# EAGLE design TFTProtoBreakout (EAGLE 7.2.0)
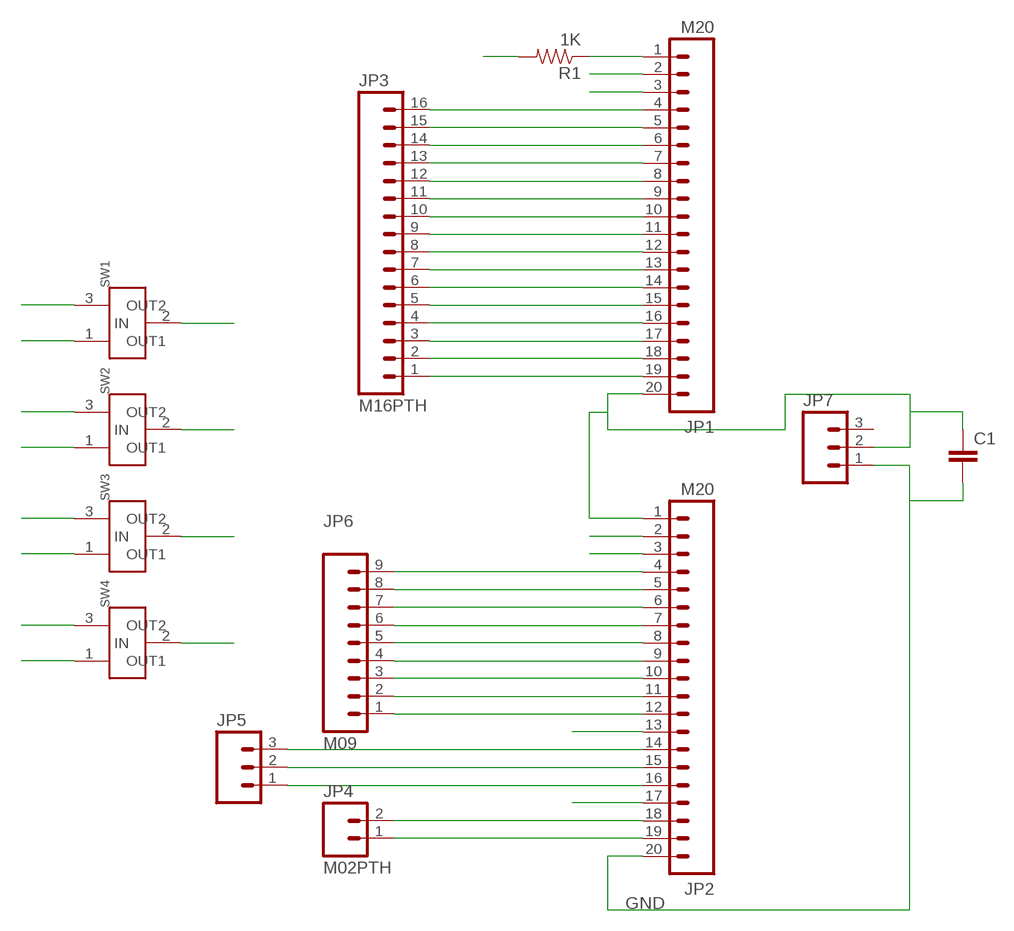
[diagram p0: schematic, sheet 1]

## Parts
C1  CAP0805  [0805]
JP1  M20  [1X20]
JP2  M20  [1X20]
JP3  M16PTH  [1X16]
JP4  M02PTH  [1X02]
JP5  M03PTH  [1X03]
JP6  M09  [1X09]
JP7  M03PTH  [1X03]
R1  1K  1KOHM1/10W1%(0603)  [0603-RES]
SW1  PCM12SMTR  [PCM12SMTR]
SW2  PCM12SMTR  [PCM12SMTR]
SW3  PCM12SMTR  [PCM12SMTR]
SW4  PCM12SMTR  [PCM12SMTR]

## Nets
D0: JP1.13 JP3.7
D1: JP2.12 JP6.1
D2: JP1.12 JP3.8
D3: JP2.11 JP6.2
D4: JP1.11 JP3.9
D5: JP2.10 JP6.3
D6: JP1.10 JP3.10
D7: JP2.9 JP6.4
D8: JP1.9 JP3.11
D9: JP2.8 JP6.5
D10: JP1.8 JP3.12
D11: JP2.7 JP6.6
D12: JP1.7 JP3.13
D13: JP2.6 JP6.7
D14: JP1.6 JP3.14
D15: JP2.5 JP6.8
D16: JP1.5 JP3.15
D17: JP2.4 JP6.9
FMARK: JP1.17 JP3.3
GND: C1.2 JP2.13 JP2.17 JP2.20 JP7.1 R1.2 SW1.1(OUT1) SW2.1(OUT1) SW3.1(OUT1) SW4.1(OUT1)
IM0: JP1.2 SW1.2(IN)
IM1: JP2.2 SW2.2(IN)
IM2: JP1.3 SW3.2(IN)
IM3: JP2.3 SW4.2(IN)
LEDK: JP1.1 R1.1
NCS: JP2.16 JP5.1
NRD: JP1.15 JP3.5
NRST: JP1.4 JP3.16
NWR_SCL: JP2.15 JP5.2
RS: JP1.16 JP3.4
SDI: JP2.14 JP5.3
SDO: JP1.14 JP3.6
VCC: C1.1 JP1.20 JP2.1 JP7.2 SW1.3(OUT2) SW2.3(OUT2) SW3.3(OUT2) SW4.3(OUT2)
X+: JP1.18 JP3.2
X-: JP1.19 JP3.1
Y+: JP2.18 JP4.2
Y-: JP2.19 JP4.1
Unconnected: JP7.3

## Library data of the parts
C1 = SparkFun-Capacitors:CAP: Capacitor Standard 0603 ceramic capacitor, and 0.1" leaded capacitor.
JP1 JP2 = SparkFun-Connectors:M20: 1x20 .1" header This is just like the LOCK variant in that the holes are staggared by 5 mil, but except for the last two holes. They are not altered from the "standard" footprint layout. This is used for a special purpose on the layout of our Graphic LCD Backpack. Make sure you want to use this device before selecting it for you project!
JP3 = SparkFun-Connectors:M16: 1x16 .1" header
JP4 = SparkFun-Connectors:M02: Standard 2-pin 0.1" header. Use with - straight break away headers ( PRT-00116) - right angle break away headers (PRT-00553) - swiss pins (PRT-00743) - machine pins (PRT-00117) - female headers (PRT-00115) Molex polarized connector foot print use with: PRT-08233 with associated crimp pins and housings. 2.54_SCREWTERM for use with PRT-10571. 3.5mm Screw Terminal footprints for PRT-08084 5mm Screw Terminal footprints for use with PRT-08433
JP5 JP7 = SparkFun-Connectors:M03: Header 3 Standard 3-pin 0.1" header. Use with straight break away headers (SKU : PRT-00116), right angle break away headers (PRT-00553), swiss pins (PRT-00743), machine pins (PRT-00117), and female headers (PRT-00115). Molex polarized connector foot print use with SKU : PRT-08232 with associated crimp pins and housings.
JP6 = SparkFun-Connectors:M09: Header 9 Standard 9-pin 0.1" header. Use with straight break away headers (SKU : PRT-00116), right angle break away headers (PRT-00553), swiss pins (PRT-00743), machine pins (PRT-00117), and female headers (PRT-00115).
R1 = SparkFun-Resistors:1KOHM1/10W1%(0603): RES-07856; PROD_ID: RES-07856
SW1-SW4 = freddyLibr:PCM12SMTR: Three pin switch. Horizontal gull wing surface mount.

## Board
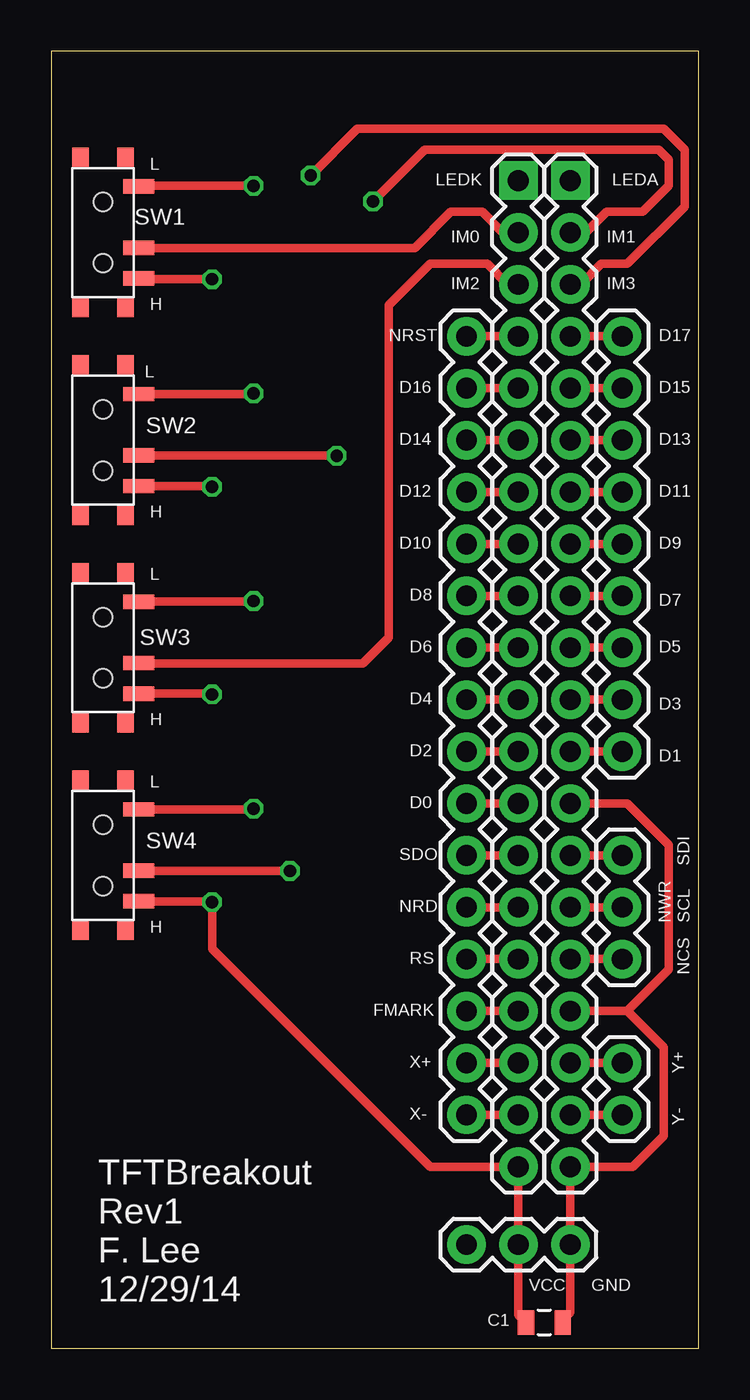
[diagram p1: board, top side]
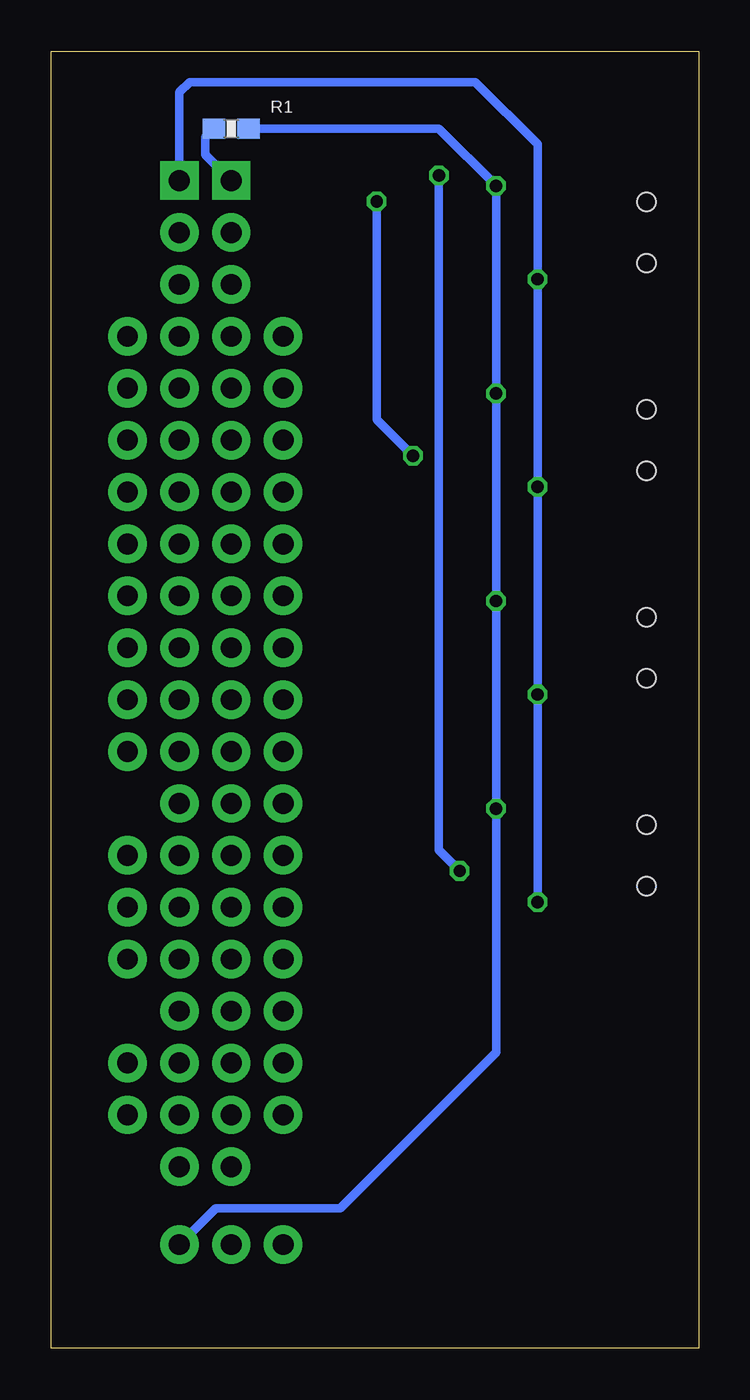
[diagram p2: board, bottom side, seen from below]

Size 31.67 x 63.49 mm. Coordinates in mm from the lower left corner, seen from the top.
Outline: 0,0 31.67,0 31.67,63.49 0,63.49 0,0
Copper layers (1*16): Top 0.0356mm / dielectric 1.5011mm / Bottom 0.0356mm
Design rules "LaenPCBOrder": minimum track width 6mil, minimum drill 13mil, track to track 6mil, track to pad 6mil, pad to pad 6mil, via to via 6mil, smd to smd 6mil, copper to edge 15mil, drill to drill 6mil, minimum pad ring 7mil, minimum via ring 7mil, stop-mask expansion 3mil, vias tented up to drill 0mil, thermal gap 10mil

### Footprints (pad centres in the part's own frame; a part is rotated, then mirrored left to right if it is on the bottom)
0805 = smd 0.8 x 1.2: 1 -0.9,0; 2 0.9,0
1X20 = drill 1.016 pad 1.88 square: 1 0,0 | drill 1.016 pad 1.88: 2 2.54,0; 3 5.08,0; 4 7.62,0; 5 10.16,0; 6 12.7,0; 7 15.24,0; 8 17.78,0; 9 20.32,0; 10 22.86,0; 11 25.4,0; 12 27.94,0; 13 30.48,0; 14 33.02,0; 15 35.56,0; 16 38.1,0; 17 40.64,0; 18 43.18,0; 19 45.72,0; 20 48.26,0
1X16 = drill 1.016 pad 1.88: 1 0,0; 2 2.54,0; 3 5.08,0; 4 7.62,0; 5 10.16,0; 6 12.7,0; 7 15.24,0; 8 17.78,0; 9 20.32,0; 10 22.86,0; 11 25.4,0; 12 27.94,0; 13 30.48,0; 14 33.02,0; 15 35.56,0; 16 38.1,0
1X02 = drill 1.016 pad 1.88: 1 0,0; 2 2.54,0
1X03 = drill 1.016 pad 1.88: 1 0,0; 2 2.54,0; 3 5.08,0
1X09 = drill 1.016 pad 1.88: 1 0,0; 2 2.54,0; 3 5.08,0; 4 7.62,0; 5 10.16,0; 6 12.7,0; 7 15.24,0; 8 17.78,0; 9 20.32,0
0603-RES = smd 1.1 x 1: 1 -0.85,0; 2 0.85,0
PCM12SMTR = smd 0.7 x 1.5: 1 -2.25,1.75; 2 0.75,1.75; 3 2.25,1.75 | smd 1 x 0.8: 4 -3.65,1.1; 5 -3.65,-1.1; 6 3.65,1.1; 7 3.65,-1.1 | hole 0.9: -1.5,0; 1.5,0

### Placement (x,y rotation side)
C1  24.13,1.27 0 top
JP1  22.86,57.15 270 top
JP2  25.4,57.15 270 top
JP3  20.32,11.43 90 top
JP4  27.94,11.43 90 top
JP5  27.94,19.05 90 top
JP6  27.94,29.21 90 top
JP7  25.4,5.08 180 top
R1  22.86,59.69 0 bottom
SW1  2.54,54.61 270 top
SW2  2.54,44.45 270 top
SW3  2.54,34.29 270 top
SW4  2.54,24.13 270 top

### Tracks (layer width: path | path; a pad name or v marks a point on that pad's centre or on a via)
D0
  Top 0.406: JP3.7 JP1.13
D1
  Top 0.406: JP6.1 JP2.12
D2
  Top 0.406: JP3.8 JP1.12
D3
  Top 0.406: JP2.11 JP6.2
D4
  Top 0.406: JP3.9 JP1.11
D5
  Top 0.406: JP6.3 JP2.10
D6
  Top 0.406: JP3.10 JP1.10
D7
  Top 0.406: JP2.9 JP6.4
D8
  Top 0.406: JP3.11 JP1.9
D9
  Top 0.406: JP6.5 JP2.8
D10
  Top 0.406: JP3.12 JP1.8
D11
  Top 0.406: JP2.7 JP6.6
D12
  Top 0.406: JP3.13 JP1.7
D13
  Top 0.406: JP6.7 JP2.6
D14
  Top 0.406: JP3.14 JP1.6
D15
  Top 0.406: JP6.8 JP2.5
D16
  Top 0.406: JP3.15 JP1.5
D17
  Top 0.406: JP2.4 JP6.9
FMARK
  Top 0.406: JP3.3 JP1.17
GND  (via drill 0.6)
  Top 0.406: 28.19,16.51 30.23,18.54 30.23,24.64 28.19,26.67 JP2.13 | JP2.17 28.19,16.51 | 28.19,16.51 29.97,14.73 29.97,10.41 28.45,8.89 JP2.20 JP7.1 25.4,1.78 25.03,1.41 C1.2 | v9.91,56.9 4.33,56.9 SW1.1 | SW2.1 9.87,46.7 v9.91,46.74 | SW3.1 9.87,36.54 v9.91,36.58 | SW4.1 9.87,26.38 v9.91,26.42
  Bottom 0.406: R1.2 12.7,59.69 v9.91,56.9 v9.91,46.74 v9.91,36.58 v9.91,26.42 9.91,14.48 17.53,6.86 23.62,6.86 JP7.1
IM0
  Top 0.406: JP1.2 22.1,54.61 21.08,55.63 19.56,55.63 17.78,53.85 4.3,53.85 SW1.2
IM1  (via drill 0.6)
  Top 0.406: JP2.2 26.16,54.61 27.18,55.63 28.96,55.63 30.23,56.9 30.23,58.17 29.72,58.67 18.29,58.67 v15.75,56.13 | v13.97,43.69 4.3,43.69 SW2.2
  Bottom 0.406: v15.75,56.13 15.75,45.47 v13.97,43.69
IM2
  Top 0.406: JP1.3 22.35,52.07 21.34,53.09 18.54,53.09 16.51,51.05 16.51,34.8 15.24,33.53 4.3,33.53 SW3.2
IM3  (via drill 0.6)
  Top 0.406: JP2.3 25.91,52.07 26.92,53.09 28.19,53.09 30.99,55.88 30.99,58.67 29.97,59.69 14.99,59.69 v12.7,57.4 | v11.68,23.37 4.3,23.37 SW4.2
  Bottom 0.406: v12.7,57.4 12.7,24.38 v11.68,23.37
LEDK
  Bottom 0.406: JP1.1 24.13,58.42 24.13,59.27 R1.1
NCS
  Top 0.406: JP5.1 JP2.16
NRD
  Top 0.406: JP3.5 JP1.15
NRST
  Top 0.406: JP3.16 JP1.4
NWR_SCL
  Top 0.406: JP5.2 JP2.15
RS
  Top 0.406: JP3.4 JP1.16
SDI
  Top 0.406: JP5.3 JP2.14
SDO
  Top 0.406: JP3.6 JP1.14
VCC  (via drill 0.6)
  Top 0.406: v7.87,52.32 4.33,52.32 SW1.3 | SW2.3 7.84,42.2 v7.87,42.16 | SW3.3 7.84,32.04 v7.87,32 | SW4.3 7.84,21.88 v7.87,21.84 7.87,19.56 18.54,8.89 JP1.20 JP7.2 22.86,1.64 C1.1
  Bottom 0.406: JP2.1 25.4,61.47 24.89,61.98 10.92,61.98 7.87,58.93 v7.87,52.32 v7.87,42.16 v7.87,32 v7.87,21.84
X+
  Top 0.406: JP3.2 JP1.18
X-
  Top 0.406: JP1.19 JP3.1
Y+
  Top 0.406: JP4.2 JP2.18
Y-
  Top 0.406: JP4.1 JP2.19

### Text on the board
tNames: L | LEDK | LEDA | IM0 | IM1 | IM2 | IM3 | H | NRST | D17 | L | D16 | D15 | D14 | D13 | D12 | D11 | H | D10 | D9 | L | D8 | D7 | D6 | D5 | D4 | D3 | H | D2 | D1 | L | D0 | SDO | SDI | NRD | NWR / SCL | H | RS | NCS | FMARK | X+ | Y+ | X- | Y- | VCC | GND | TFTBreakout / Rev1 / F. Lee / 12/29/14